# Altium schematic sheet ethernet_1gbe_ext_magn.SchDoc
size A4
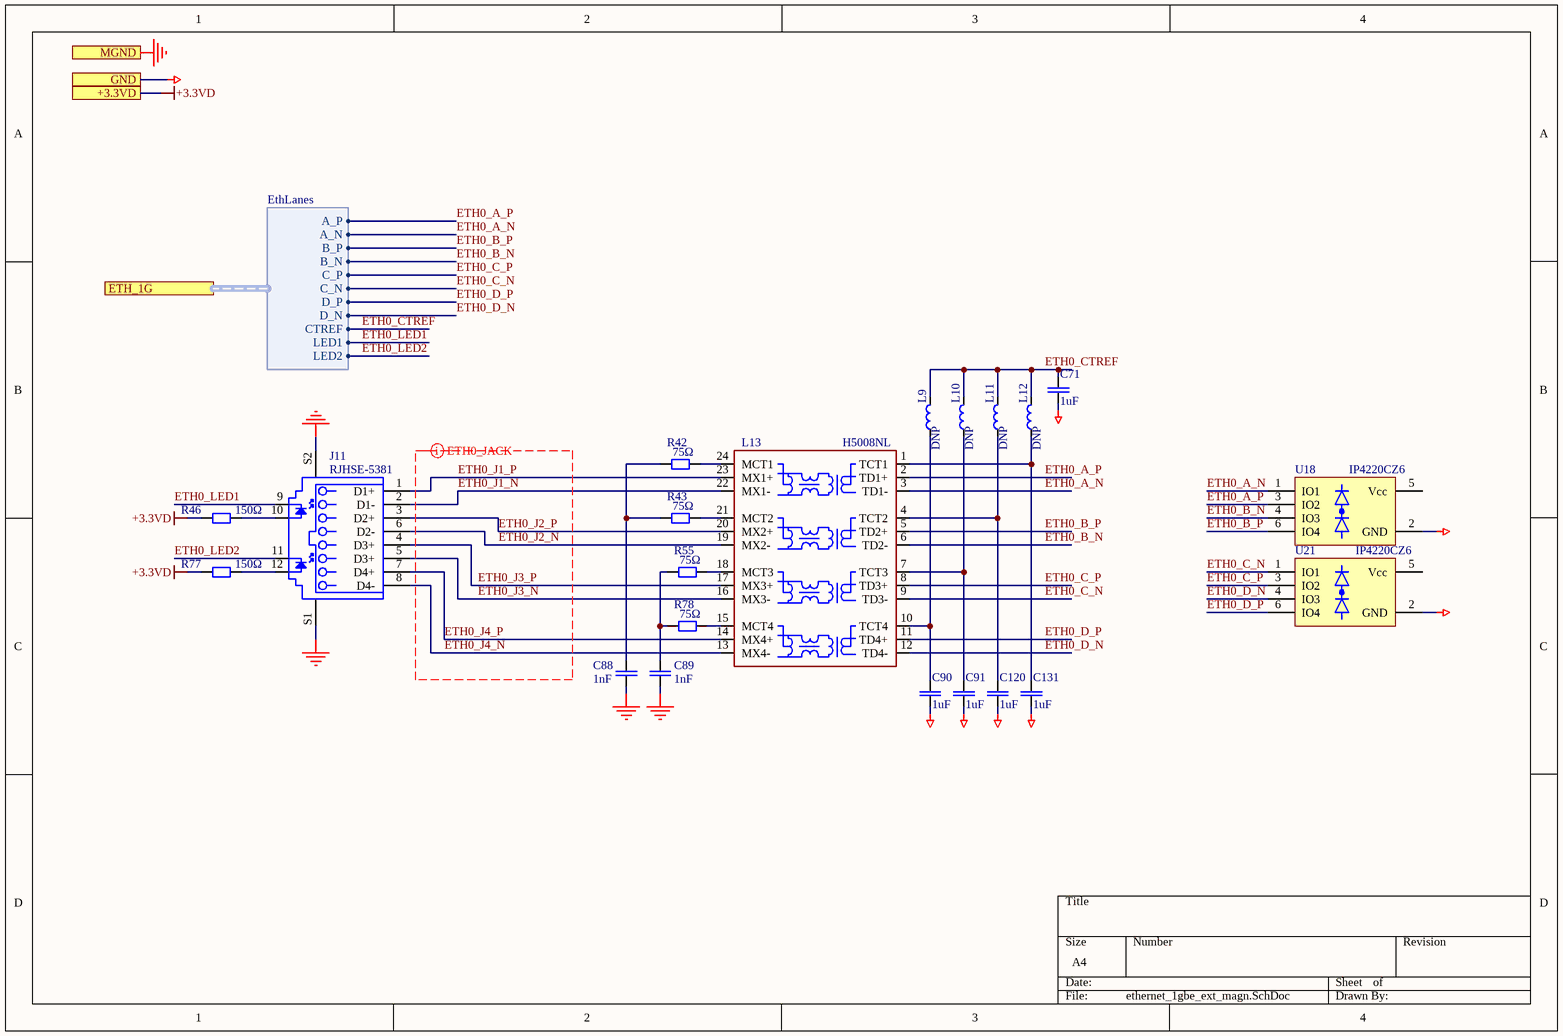
[diagram p0: ethernet_1gbe_ext_magn.SchDoc]

## Parts
C71  1uF  [CAPC2012N]
C88  value 1nF  [CAPC3216N]  (hidden comment: 1nF; 2kV)
C89  value 1nF  [CAPC3216N]  (hidden comment: 1nF; 2kV)
C90  1uF  [CAPC2012N]
C91  1uF  [CAPC2012N]
C120  1uF  [CAPC2012N]
C131  1uF  [CAPC2012N]
J11  RJHSE-5381  [AMPH-RJHSE-5381_V]
L9  DNP  [INDC2012N]
L10  DNP  [INDC2012N]
L11  DNP  [INDC2012N]
L12  DNP  [INDC2012N]
L13  H5008NL  [SMD_HX508]
R42  75Ω  [RESC2012N]
R43  75Ω  [RESC2012N]
R46  150Ω  [RESC2012N]
R55  75Ω  [RESC2012N]
R77  150Ω  [RESC2012N]
R78  75Ω  [RESC2012N]
U18  IP4220CZ6  [SOT95P285X110-6N]
U21  IP4220CZ6  [SOT95P285X110-6N]

## Ports
+3.3VD, ETH_1G (harness EthLanes), GND, MGND

## Harnesses
EthLanes: A_P, A_N, B_P, B_N, C_P, C_N, D_P, D_N, LED1, LED2, CTREF

## Nets
+3.3VD: R46.1 R77.1 ; port +3.3VD
GND: C71.1 C90.1 C91.1 C120.1 C131.1 U18.2(GND) U21.2(GND) ; port GND
MGND: C88.1 C89.1 J11.S1 J11.S2 ; port MGND
ETH0_A_N: L13.3(TD1-) U18.1(IO1) ; port ETH_1G.A_N
ETH0_A_P: L13.2(TD1+) U18.3(IO2) ; port ETH_1G.A_P
ETH0_B_N: L13.6(TD2-) U18.4(IO3) ; port ETH_1G.B_N
ETH0_B_P: L13.5(TD2+) U18.6(IO4) ; port ETH_1G.B_P
ETH0_C_N: L13.9(TD3-) U21.1(IO1) ; port ETH_1G.C_N
ETH0_C_P: L13.8(TD3+) U21.3(IO2) ; port ETH_1G.C_P
ETH0_CTREF: C71.2 L9.2 L10.2 L11.2 L12.2 ; port ETH_1G.CTREF
ETH0_D_N: L13.12(TD4-) U21.4(IO3) ; port ETH_1G.D_N
ETH0_D_P: L13.11(TD4+) U21.6(IO4) ; port ETH_1G.D_P
ETH0_J1_N: J11.2(D1-) L13.22(MX1-)
ETH0_J1_P: J11.1(D1+) L13.23(MX1+)
ETH0_J2_N: J11.6(D2-) L13.19(MX2-)
ETH0_J2_P: J11.3(D2+) L13.20(MX2+)
ETH0_J3_N: J11.5(D3+) L13.16(MX3-)
ETH0_J3_P: J11.4(D3+) L13.17(MX3+)
ETH0_J4_N: J11.8(D4-) L13.13(MX4-)
ETH0_J4_P: J11.7(D4+) L13.14(MX4+)
ETH0_LED1: J11.9 ; port ETH_1G.LED1
ETH0_LED2: J11.11 ; port ETH_1G.LED2
NetC88_2: C88.2 R42.1 R43.1
NetC89_2: C89.2 R55.1 R78.1
NetC90_2: C90.2 L9.1 L13.10(TCT4)
NetC91_2: C91.2 L10.1 L13.7(TCT3)
NetC120_2: C120.2 L11.1 L13.4(TCT2)
NetC131_2: C131.2 L12.1 L13.1(TCT1)
NetJ11_10: J11.10 R46.2
NetJ11_12: J11.12 R77.2
NetL13_15: L13.15(MCT4) R78.2
NetL13_18: L13.18(MCT3) R55.2
NetL13_21: L13.21(MCT2) R43.2
NetL13_24: L13.24(MCT1) R42.2

Not connected (* = marked no-connect by the designer): U18 5(Vcc); U21 5(Vcc)

## Layout directives
differential pair; rule Differential Pairs Routing [Pref Gap = 0.254mm    Min Gap  = 0.075mm    Max Gap  = 0.254mmPref Width = 0.3mm    Min Width  = 0.075mm    Max Width  = 0.5mm]: ETH0_J1_N, ETH0_J1_P, ETH0_J2_N, ETH0_J2_P, ETH0_J3_N, ETH0_J3_P, ETH0_J4_N, ETH0_J4_P

## Library data of the parts
C71 C90 C91 C120 C131 = CAPC: Generic ceramic SMD capacitor; Pkg: 0805; Maintainer: Evgeniy Kotov; SMD Solders: 2; THD Solders: 0; Voltage Rating: 10V; PartField: 1uF; Last Change Data: 06.03.2017; Release Date: 06.03.2017; Value: 1uF
C88 = CAPC: Generic ceramic SMD capacitor / +' x '+Voltage Rating; Pkg: 1206; Maintainer: Evgeniy Kotov; SMD Solders: 2; THD Solders: 0; PartField: 1nF; Last Change Data: 06.03.2017; Release Date: 06.03.2017; VoltageRating: 2kV
C89 = CAPC: Generic ceramic SMD capacitor; Pkg: 1206; Maintainer: Evgeniy Kotov; SMD Solders: 2; THD Solders: 0; PartField: 1nF; Last Change Data: 06.03.2017; Release Date: 06.03.2017; VoltageRating: 2kV
J11 = RJ45-RJHSE-5381: High Speed RJ45, Modular Jack, 8 Position, 8 Contacts, Shielded, with LEDs, -55 to 85 degC,12-Pin THD, RoHS, Tray; Manufacturer: Amphenol; Number of Positions/Contacts: 8p8c(RJ45,Ethernet); Number of Ports: 1; Catalog Drawings: RJ45SeriesRightAngle; PCN Design/Specification: MultipleSeriesCopper29/Jan/2009RJHSEShieldMaterial30/Jun/2015; Other Names: RJHSE5381; Online Catalog: RJHSESeries; Featured Product: ModularJacksProductSolutions; Tab Direction: Up; Shielding: Shielded,EMIFinger; LED Color: Yellow-Green; 3D Model: RJHSE538x.stpRJHSE538x.igs; Pkg: LAN conn; SMD Solders: 0; THD Solders: 14; Category: Connectors,Interconnects; Termination: Solder; Housing Material: Thermoplastic; Mounting Type: ThroughHole; Family: ModularConnectors-Jacks; Orientation: 90°Angle(Right); Features: BoardLock; Contact Material: PhosphorBronze; Mounting Technology: ThroughHole; Number of Rows: 1; Standard Package: 120; Ratings: -; Operating Temperature: -55°C~85°C; Series: RJHSE; Contact Finish: Gold; Package Reference: RJHSE-5381; Ingress Protection: -; Package Description: 12-Pin Through Hole Device, Body 16.51 x 15.75 mm; Contact Finish Thickness: 50µin(1.27µm); Datasheet URL: https://datasheet.ciiva.com/16481/rjhse538x-16481714.pdf; Datasheet Version: Rev. K, 04/2014; Connector Type: Jack; Manufacturer URL: http://www.amphenol.com/; Packaging: Tray; PartField: RJHSE-5381; Value: RJHSE-5381
L9-L12 = BLM21RK102SN1D: Ferrite Beads, 0805, 1 kOhm; Pkg: 0805; Vendor: Murata; Maintainer: Evgeniy Kotov; SMD Solders: 2; THD Solders: 0; DC Current: 200mA; Tolerance: 25%; DC Resistance: 500mΩ; PartField: BLM21RK102SN1D; Release Date: 30.03.2017; Last Change Data: 30.03.2017; Temperature Range: -55°C to +125°C; Value: DNP
L13 = LAN_1G_TR_H5008NL: LAN Transformer fog 1GbE, 12 coils, 4 pairs.; Vendor: Pulse Electronics; Maintainer: Evgeniy Kotov; SMD Solders: 2; THD Solders: 0; Tolerance: 2%; PartField: H5008NL; Pkg: H5008NL; Release Date: 31.03.2017; Last Change Data: 31.03.2017; Temperature Range: -25°C to +85°C; Value: H5008NL
R42 R43 R46 R55 R77 R78 = RESC: Resistor, Generic, SMD; Pkg: 0805; Maintainer: Evgeniy Kotov; SMD Solders: 2; THD Solders: 0; Release Date: 06.03.2017; Last Change Data: 09.03.2017
  R42 R43 R55 R78: PartField: 75Ω; Value: 75Ω
  R46 R77: PartField: 150Ω; Value: 150Ω
U18 U21 = IP4220CZ6: Transimpedance Amplifier; Selectable-Feedback Resistance; Pkg: SOT457; SMD Solders: 6; THD Solders: 0; Maintainer: Evgeniy Kotov; Vendor: NXP; PartField: IP4220CZ6; ComponentLink1URL: http://assets.nexperia.com/documents/data-sheet/IP4220CZ6.pdf; ComponentLink1Description: Datasheet; Last Change Date: 28.03.2017; Release Date: 28.03.2017; Value: IP4220CZ6